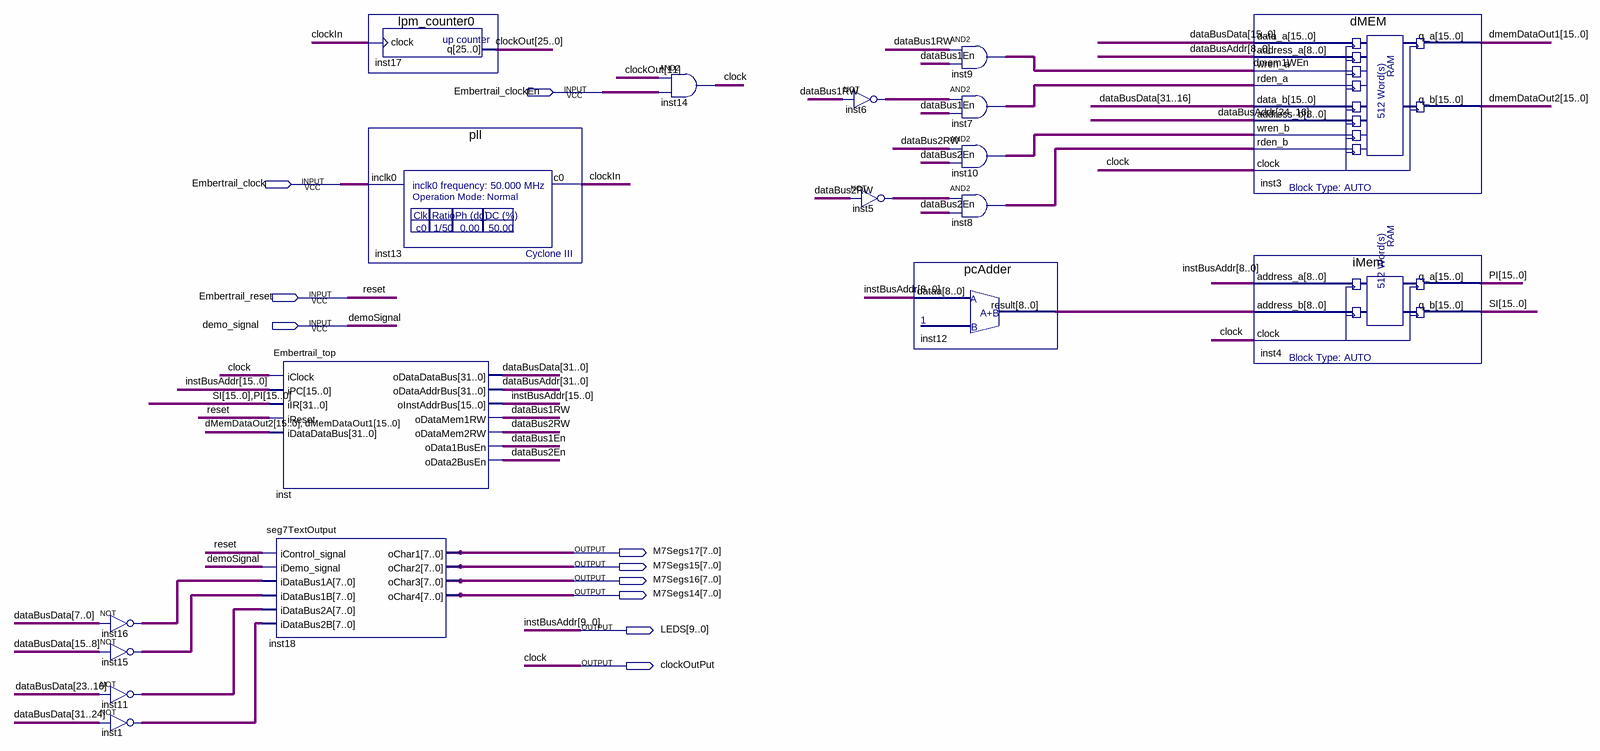
[diagram p0: schematic sheet]
// Quartus schematic embertrail_fpga_deployment_top.bdf as structural Verilog: 18 symbols, 10 pins
module embertrail_fpga_deployment_top (
  input  Embertrail_clockEn,
  input  Embertrail_clock,
  input  Embertrail_reset,
  input  demo_signal,
  output [7:0] M7Segs17,
  output [7:0] M7Segs15,
  output [7:0] M7Segs16,
  output [7:0] M7Segs14,
  output [9:0] LEDS,
  output clockOutPut
);

  wire clockIn, dataBus1En, dataBus1RW, dataBus2En, dataBus2RW, dmem1WEn, inst5_out, inst6_out, inst7_out,
       inst8_out, inst10_out;
  wire [7:0] inst1_out, inst11_out, inst15_out, inst16_out;
  wire [8:0] inst12_result;
  wire [15:0] dmemDataOut1, dmemDataOut2, PI, SI;
  wire [15:10] instBusAddr;
  wire [25:0] clockOut;
  wire [31:0] dataBusAddr, dataBusData;

  assign inst16_out = ~dataBusData[7:0];  // NOT inst16, 8 bits wide
  assign inst15_out = ~dataBusData[15:8];  // NOT inst15, 8 bits wide
  assign inst11_out = ~dataBusData[23:16];  // NOT inst11, 8 bits wide
  assign inst1_out = ~dataBusData[31:24];  // NOT inst1, 8 bits wide
  Embertrail_top inst (
    .iClock(clockOutPut), .iPC({instBusAddr, LEDS}), .iIR({SI, PI}), .iReset(Embertrail_reset),
    .iDataDataBus({dmemDataOut2, dmemDataOut1}), .oDataDataBus(dataBusData), .oDataAddrBus(dataBusAddr),
    .oInstAddrBus({instBusAddr, LEDS}), .oDataMem1RW(dataBus1RW), .oDataMem2RW(dataBus2RW),
    .oData1BusEn(dataBus1En), .oData2BusEn(dataBus2En));
  seg7TextOutput inst18 (
    .iControl_signal(Embertrail_reset), .iDemo_signal(demo_signal), .iDataBus1A(inst16_out),
    .iDataBus1B(inst15_out), .iDataBus2A(inst11_out), .iDataBus2B(inst1_out), .oChar1(M7Segs17),
    .oChar2(M7Segs15), .oChar3(M7Segs16), .oChar4(M7Segs14));
  lpm_counter0 inst17 (.clock(clockIn), .q(clockOut));
  pll inst13 (.inclk0(Embertrail_clock), .c0(clockIn));
  and inst14 (clockOutPut, clockOut[11], Embertrail_clockEn);
  not inst6 (inst6_out, dataBus1RW);
  not inst5 (inst5_out, dataBus2RW);
  pcAdder inst12 (.dataa(LEDS[8:0]), .result(inst12_result));
  and inst9 (dmem1WEn, dataBus1RW, dataBus1En);
  and inst7 (inst7_out, inst6_out, dataBus1En);
  and inst10 (inst10_out, dataBus2RW, dataBus2En);
  and inst8 (inst8_out, inst5_out, dataBus2En);
  dMEM inst3 (
    .data_a(dataBusData[15:0]), .address_a(dataBusAddr[8:0]), .wren_a(dmem1WEn), .rden_a(inst7_out),
    .data_b(dataBusData[31:16]), .address_b(dataBusAddr[24:16]), .wren_b(inst10_out), .rden_b(inst8_out),
    .clock(clockOutPut), .q_a(dmemDataOut1), .q_b(dmemDataOut2));
  iMem inst4 (.address_a(LEDS[8:0]), .address_b(inst12_result), .clock(clockOutPut), .q_a(PI), .q_b(SI));

  // Other names for the same wires on the sheet: clock = clockOutPut; demoSignal = demo_signal;
  //   instBusAddr[9:0] = LEDS; reset = Embertrail_reset
endmodule
